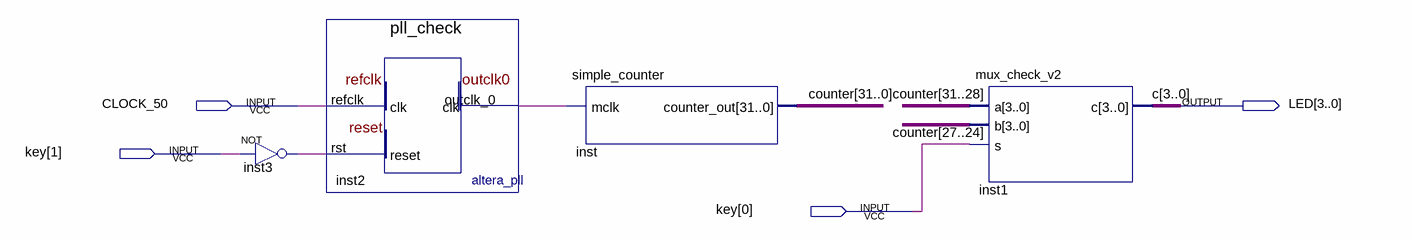
[diagram p0: schematic sheet]
// Quartus schematic Memory_check.bdf as structural Verilog: 4 symbols, 4 pins
module Memory_check (
  input  CLOCK_50,
  input  [1:0] key,
  output [3:0] LED
);

  wire inst2_outclk_0, inst3_out;
  wire [31:0] counter;

  not inst3 (inst3_out, key[1]);
  pll_check inst2 (.refclk(CLOCK_50), .rst(inst3_out), .outclk_0(inst2_outclk_0));
  simple_counter inst (.mclk(inst2_outclk_0), .counter_out(counter));
  mux_check_v2 inst1 (.a(counter[31:28]), .b(counter[27:24]), .s(key[0]), .c(LED));

  // Other names for the same wires on the sheet: c[3:0] = LED
endmodule
